# EAGLE design Pi_grammer_SPEEDY_SPI_V1 (EAGLE 7.6.0)
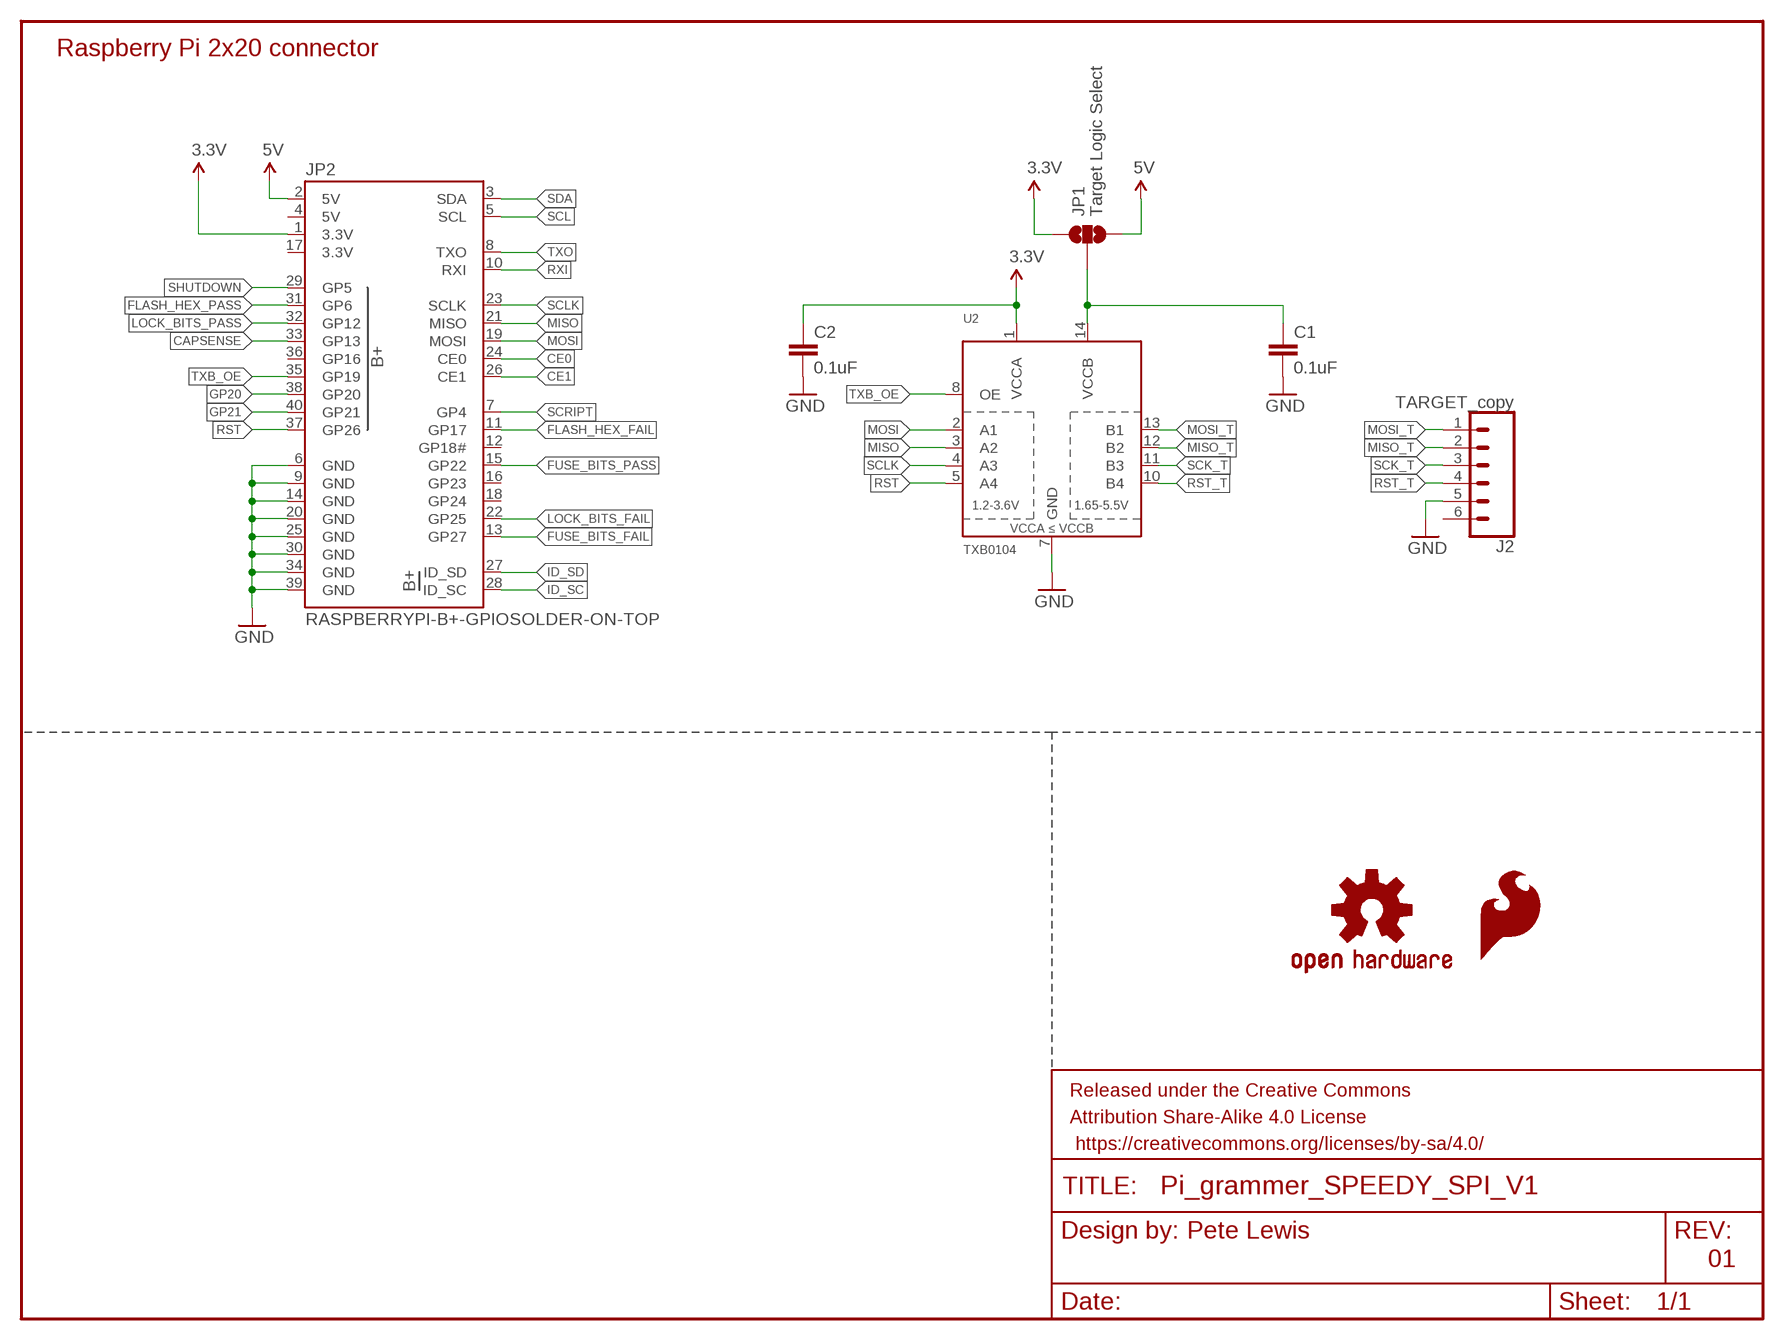
[diagram p0: schematic, sheet 1]

## Parts
C1  0.1uF  0.1UF-0603-25V-(+80/-20%)  [0603]
C2  0.1uF  0.1UF-0603-25V-(+80/-20%)  [0603]
FRAME1  FRAME-LETTER  [CREATIVE_COMMONS]
J2  TARGET_copy  CONN_06POLAR  [MOLEX-1X6]
JP1  Target Logic Select  JUMPER-SMT_3_NO_SILK  [SMT-JUMPER_3_NO_SILK]
JP2  RASPBERRYPI-B+-GPIOSOLDER-ON-TOP  [2X20-SHROUDED-SOLDER-ON-TOP]
LOGO1  SFE_LOGO_FLAME.1_INCH  [SFE_LOGO_FLAME_.1]
LOGO2  OSHW-LOGOS  [OSHW-LOGO-S]
U2  TXB0104  TXB0104PWRSOIC14  [SO14]

## Nets
3.3V: C2.1 JP1.1 JP2.1(3.3V) U2.1(VCCA)
5V: JP1.3 JP2.2(5V)
CAPSENSE: JP2.33(GP13)
CE0: JP2.24(CE0)
CE1: JP2.26(CE1)
FLASH_HEX_FAIL: JP2.11(GP17)
FLASH_HEX_PASS: JP2.31(GP6)
FUSE_BITS_FAIL: JP2.13(GP27)
FUSE_BITS_PASS: JP2.15(GP22)
GND: C1.2 C2.2 J2.5 JP2.6(GND) JP2.9(GND) JP2.14(GND) JP2.20(GND) JP2.25(GND) JP2.30(GND) JP2.34(GND) JP2.39(GND) U2.7(GND)
GP20: JP2.38(GP20)
GP21: JP2.40(GP21)
ID_SC: JP2.28(ID_SC)
ID_SD: JP2.27(ID_SD)
LOCK_BITS_FAIL: JP2.22(GP25)
LOCK_BITS_PASS: JP2.32(GP12)
MISO: JP2.21(MISO) U2.3(A2)
MISO_T: J2.2 U2.12(B2)
MOSI: JP2.19(MOSI) U2.2(A1)
MOSI_T: J2.1 U2.13(B1)
N$9: C1.1 JP1.2 U2.14(VCCB)
RST: JP2.37(GP26) U2.5(A4)
RST_T: J2.4 U2.10(B4)
RXI: JP2.10(RXI)
SCK_T: J2.3 U2.11(B3)
SCL: JP2.5(SCL)
SCLK: JP2.23(SCLK) U2.4(A3)
SCRIPT: JP2.7(GP4)
SDA: JP2.3(SDA)
SHUTDOWN: JP2.29(GP5)
TXB_OE: JP2.35(GP19) U2.8(OE)
TXO: JP2.8(TXO)
Unconnected: J2.6 JP2.12(GP18#) JP2.16(GP23) JP2.18(GP24) JP2.36(GP16)

## Notes on the sheet
- Raspberry Pi 2x20 connector
- Pete Lewis
- 01

## Power pins joined to a net without a drawn wire
3.3V: JP2.17(3.3V)
5V: JP2.4(5V)

## Library data of the parts
C1 C2 = SparkFun-Capacitors:0.1UF: 0.1µF ceramic capacitors A capacitor is a passive two-terminal electrical component used to store electrical energy temporarily in an electric field.; PROD_ID: CAP-00810
FRAME1 = SparkFun-Aesthetics:FRAME-LETTER: Schematic Frame - Letter Standard 8.5x11 US Letter frame
J2 = SparkFun-Connectors:CONN_06: Header 6 Standard 6-pin 0.1" header. Use with straight break away headers (SKU : PRT-00116), right angle break away headers (PRT-00553), swiss pins (PRT-00743), machine pins (PRT-00117), and female headers (PRT-00115). Molex polarized connector foot print use with SKU : PRT-08094 with associated crimp pins and housings. NOTES ON THE VARIANTS LOCK and LOCK_LONGPADS... This footprint was designed to help hold the alignment of a through-hole component (i.e. 6-pin header) while soldering it into place. You may notice that each hole has been shifted either up or down by 0.005 of an inch from it's more standard position (which is a perfectly straight line). This slight alteration caused the pins (the squares in the middle) to touch the edges of the holes. Because they are alternating, it causes a "brace" to hold the component in place. 0.005 has proven to be the perfect amount of "off-center" position when using our standard breakaway headers. Although looks a little odd when you look at the bare footprint, once you have a header in there, the alteration is very hard to notice. Also,if you push a header all the way into place, it is covered up entirely on the bottom side. This idea of altering the position of holes to aid alignment will be further integrated into the Sparkfun Library for other footprints. It can help hold any component with 3 or more connection pins.; PROD_ID: CONN-09698
JP1 = SparkFun-Jumpers:JUMPER-SMT_3_NO: Normally open jumper This jumper has three pads in close proximity to each other. Apply solder to close the connection(s).
JP2 = SparkFun-Boards:RASPBERRYPI-B+-GPIO: Raspberry Pi B+ GPIO Header 2x20 pin connector
LOGO1 = SparkFun-Aesthetics:SFE_LOGO_FLAME: SFE Logo, flame only This is the SparkFun flame logo. The logo on the schematic will always be the same size; the package variant is the height of the flame. Default layer for the logo on the board is tSilk.
LOGO2 = SparkFun-Aesthetics:OSHW-LOGO: Open Source Hardware Logo This logo indicates the piece of hardware it is found on incorporates a OSHW license and/or adheres to the definition of open source hardware found here: http://freedomdefined.org/OSHW
U2 = SparkFun-IC-Comms:TXB0104PWR: 4-Bit Bi-Directional Level Shifter 1.2V-3.6V (VCCA) to 1.65V-5.5V (VCCB) bi-directional level shifter with auto direction sensing. Max data rate - VCCA 1.8V: 20Mbps (50ns), VCCA 3.3V: 100Mbps (10ns) Digikey: 296-21929-1-ND (TSSOP) Datasheet <http://cdn.sparkfun.com/datasheets/BreakoutBoards/txb0104.pdf> SparkFun Products SparkFun Cellular Shield - MG2639 <https://www.sparkfun.com/products/13120> (CEL-13120) SparkFun Level Shifting microSD Breakout <https://www.sparkfun.com/products/13743> (DEV-13743) SparkFun Voltage-Level Translator Breakout - TXB0104 <https://www.sparkfun.com/products/11771> (BOB-11771) SparkFun Block for Intel® Edison - UART <https://www.sparkfun.com/products/13040> (DEV-13040) SparkFun Block for Intel® Edison - Arduino <https://www.sparkfun.com/products/13036> (DEV-13036); PROD_ID: IC-11329

## Board
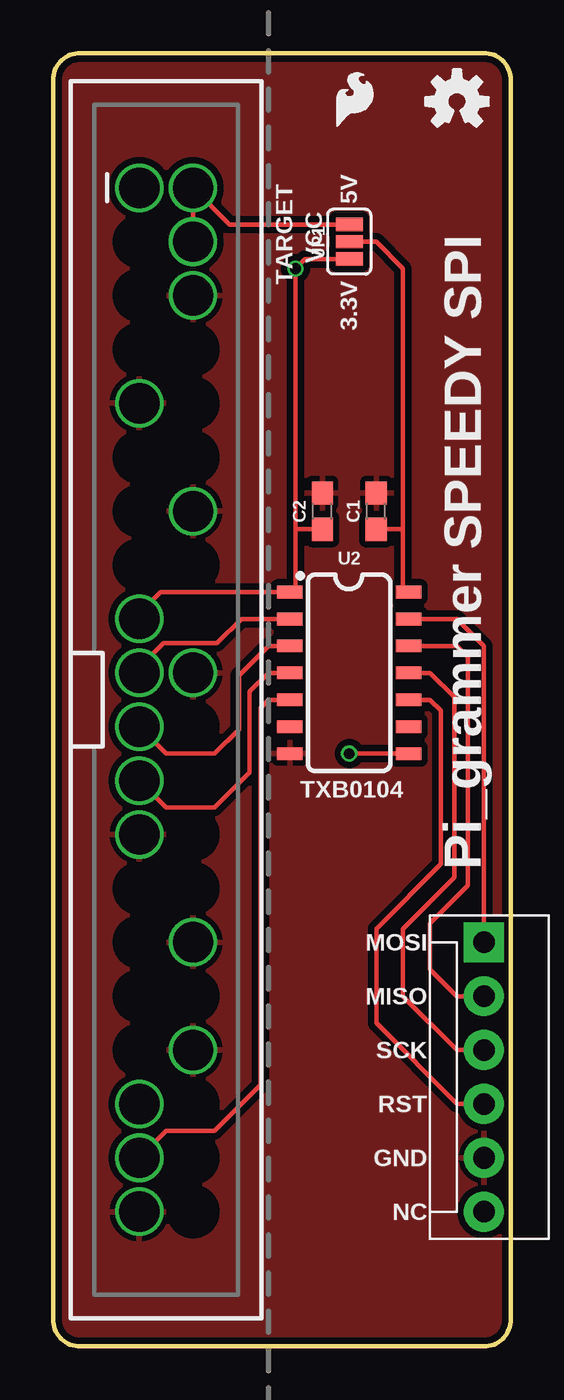
[diagram p1: board, top side]
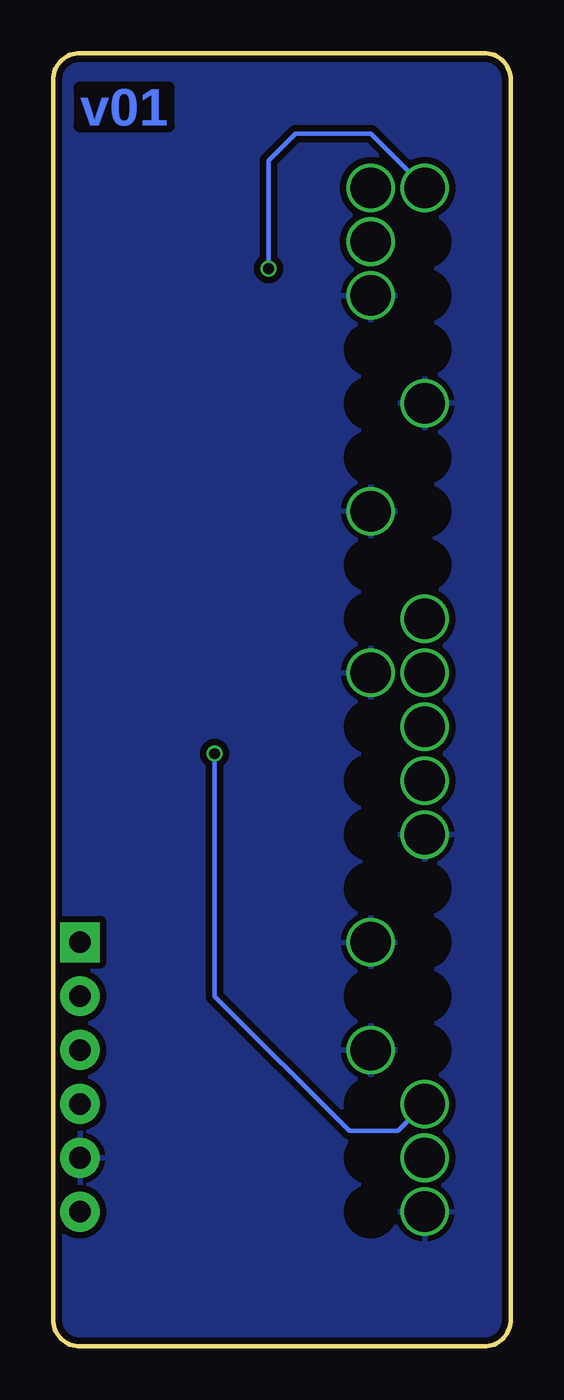
[diagram p2: board, bottom side, seen from below]

Size 21.59 x 60.96 mm. Coordinates in mm from the lower left corner, seen from the top.
Outline: 21.59,59.69 21.59,1.27 arc-90 20.32,0 1.27,0 arc-90 0,1.27 0,59.69 arc-90 1.27,60.96 20.32,60.96 arc-90 21.59,59.69
Copper layers (1*16): Top 0.035mm / dielectric 1.5mm / Bottom 0.035mm
Design rules "SparkFun-2-layer-STANDARD *": minimum track width 8mil, minimum drill 20mil, track to track 10mil, track to pad 8mil, pad to pad 8mil, via to via 10mil, smd to smd 8mil, copper to edge 8mil, drill to drill 8mil, minimum pad ring 0mil, minimum via ring 0mil, stop-mask expansion 4mil, vias tented up to drill 25mil, thermal gap 10mil

### Footprints (pad centres in the part's own frame; a part is rotated, then mirrored left to right if it is on the bottom)
0603 = smd 1.1 x 1: 1 -0.85,0; 2 0.85,0
MOLEX-1X6 = drill 1.016 pad 1.88 square: 1 0,0 | drill 1.016 pad 1.88: 2 2.54,0; 3 5.08,0; 4 7.62,0; 5 10.16,0; 6 12.7,0
SMT-JUMPER_3_NO_SILK = smd 0.635 x 1.27: 1 -0.813,0; 2 0,0; 3 0.813,0
2X20-SHROUDED-SOLDER-ON-TOP = drill 1.905 pad 2.286: 1 -1.27,24.13; 2 1.27,24.13; 4 1.27,21.59; 6 1.27,19.05; 9 -1.27,13.97; 14 1.27,8.89; 17 -1.27,3.81; 19 -1.27,1.27; 20 1.27,1.27; 21 -1.27,-1.27; 23 -1.27,-3.81; 25 -1.27,-6.35; 30 1.27,-11.43; 34 1.27,-16.51; 35 -1.27,-19.05; 37 -1.27,-21.59; 39 -1.27,-24.13 | drill 1.905 pad 0.254: 3 -1.27,21.59; 5 -1.27,19.05; 7 -1.27,16.51; 8 1.27,16.51; 10 1.27,13.97; 11 -1.27,11.43; 12 1.27,11.43; 13 -1.27,8.89; 15 -1.27,6.35; 16 1.27,6.35; 18 1.27,3.81; 22 1.27,-1.27; 24 1.27,-3.81; 26 1.27,-6.35; 27 -1.27,-8.89; 28 1.27,-8.89; 29 -1.27,-11.43; 31 -1.27,-13.97; 32 1.27,-13.97; 33 -1.27,-16.51; 36 1.27,-19.05; 38 1.27,-21.59; 40 1.27,-24.13
SO14 = smd 0.6 x 1.2: 1 -3.81,-2.8; 2 -2.54,-2.8; 3 -1.27,-2.8; 4 0,-2.8; 5 1.27,-2.8; 6 2.54,-2.8; 7 3.81,-2.8; 8 3.81,2.8; 9 2.54,2.8; 10 1.27,2.8; 11 0,2.8; 12 -1.27,2.8; 13 -2.54,2.8; 14 -3.81,2.8

### Placement (x,y rotation side)
C1  15.24,39.37 90 top
C2  12.7,39.37 90 top
FRAME1  -22.86,-36.83 0 top  (outside the outline)
J2  20.32,19.05 270 top
JP1  13.97,52.07 90 top
JP2  5.33,30.48 0 top
LOGO1  13.08,57.15 0 top
LOGO2  19.05,58.67 0 top
U2  13.97,31.75 270 top

### Tracks (layer width: path | path; a pad name or v marks a point on that pad's centre or on a via)
3.3V  (via drill 0.51)
  Top 0.203: JP1.1 11.89,51.26 v11.43,50.8 11.43,38.52 | JP2.17 4.06,34.54 5.08,35.56 U2.1 11.43,35.82 11.43,38.1 11.43,38.52 | C2.1 11.43,38.52
  Bottom 0.203: v11.43,50.8 11.43,55.88 10.16,57.15 6.6,57.15 JP2.1
5V
  Top 0.203: JP2.4 JP2.2 8.33,52.88 JP1.3
GND
  pour Bottom (isolate 0.305): 0,60.96 21.59,60.96 21.59,0 0,0
  pour Top (isolate 0.305): 0,60.96 0,1.27 arc90 1.27,0 21.59,0 21.59,59.69 arc90 20.32,60.96
MISO
  Top 0.203: U2.3 10.16,33.02 8.76,31.62 8.76,29.08 7.62,27.94 5.33,27.94 JP2.21
MISO_T
  Top 0.203: J2.2 19.05,16.51 17.78,17.78 17.78,19.94 19.56,21.72 19.56,32.51 19.05,33.02 U2.12
MOSI
  Top 0.203: JP2.19 4.06,32 5.21,33.15 7.75,33.15 8.89,34.29 U2.2
MOSI_T
  Top 0.203: J2.1 20.32,33.02 19.05,34.29 U2.13
N$9
  Top 0.203: JP1.2 15.24,52.07 16.51,50.8 16.51,39.37 16.51,38.52 | 16.51,38.52 16.51,35.82 U2.14 | C1.1 16.51,38.52
RST
  Top 0.203: U2.5 10.16,30.48 9.78,30.1 9.78,12.32 7.62,10.16 5.33,10.16 JP2.37
RST_T
  Top 0.203: J2.4 19.05,11.43 15.24,15.24 15.24,19.68 18.29,22.73 18.29,29.97 17.78,30.48 U2.10
SCK_T
  Top 0.203: J2.3 19.05,13.97 16.51,16.51 16.51,19.68 18.92,22.1 18.92,30.61 17.78,31.75 U2.11
SCLK
  Top 0.203: U2.4 10.16,31.75 9.27,30.86 9.27,27.05 7.62,25.4 5.33,25.4 JP2.23
TXB_OE  (via drill 0.51)
  Top 0.203: U2.8 v13.97,27.94
  Bottom 0.203: v13.97,27.94 13.97,16.51 7.62,10.16 5.33,10.16 JP2.35

### Text on the board
Bottom: v01
tPlace: 5V | VCC | TARGET | 3.3V | TXB0104 | Pi_grammer SPEEDY SPI | MOSI | MISO | SCK | RST | GND | NC
Reference: HARDWARE # | Pi_grammer | RASPI / AVR / PROGRAMMER | POWER | STAT | SUCCESS | FAIL | FUSE BITS | FLASH HEX | LOCK BITS | GP20 | SERIAL UPLOAD | GND | GP21 | AT42QT1010 | 0.1uF | MOSI | 10K | 10nF | TAP | 1K | MISO | TO | SCK | RST | PROGRAM | GND | SHUTDOWN / RASPI | NC
tDocu: EDGE of raspi enclosure | Pete Lewis